# Altium schematic sheet FRONT_PWR.SchDoc: SDR200
size 420 x 297 mm; DocumentNumber: XXXX.468179.001 Э3; SheetNumber: 1; SheetTotal: 7; Title2str: Передняя панель; DocumentType: Схема электрическая принципиальная; Scale: 1:1
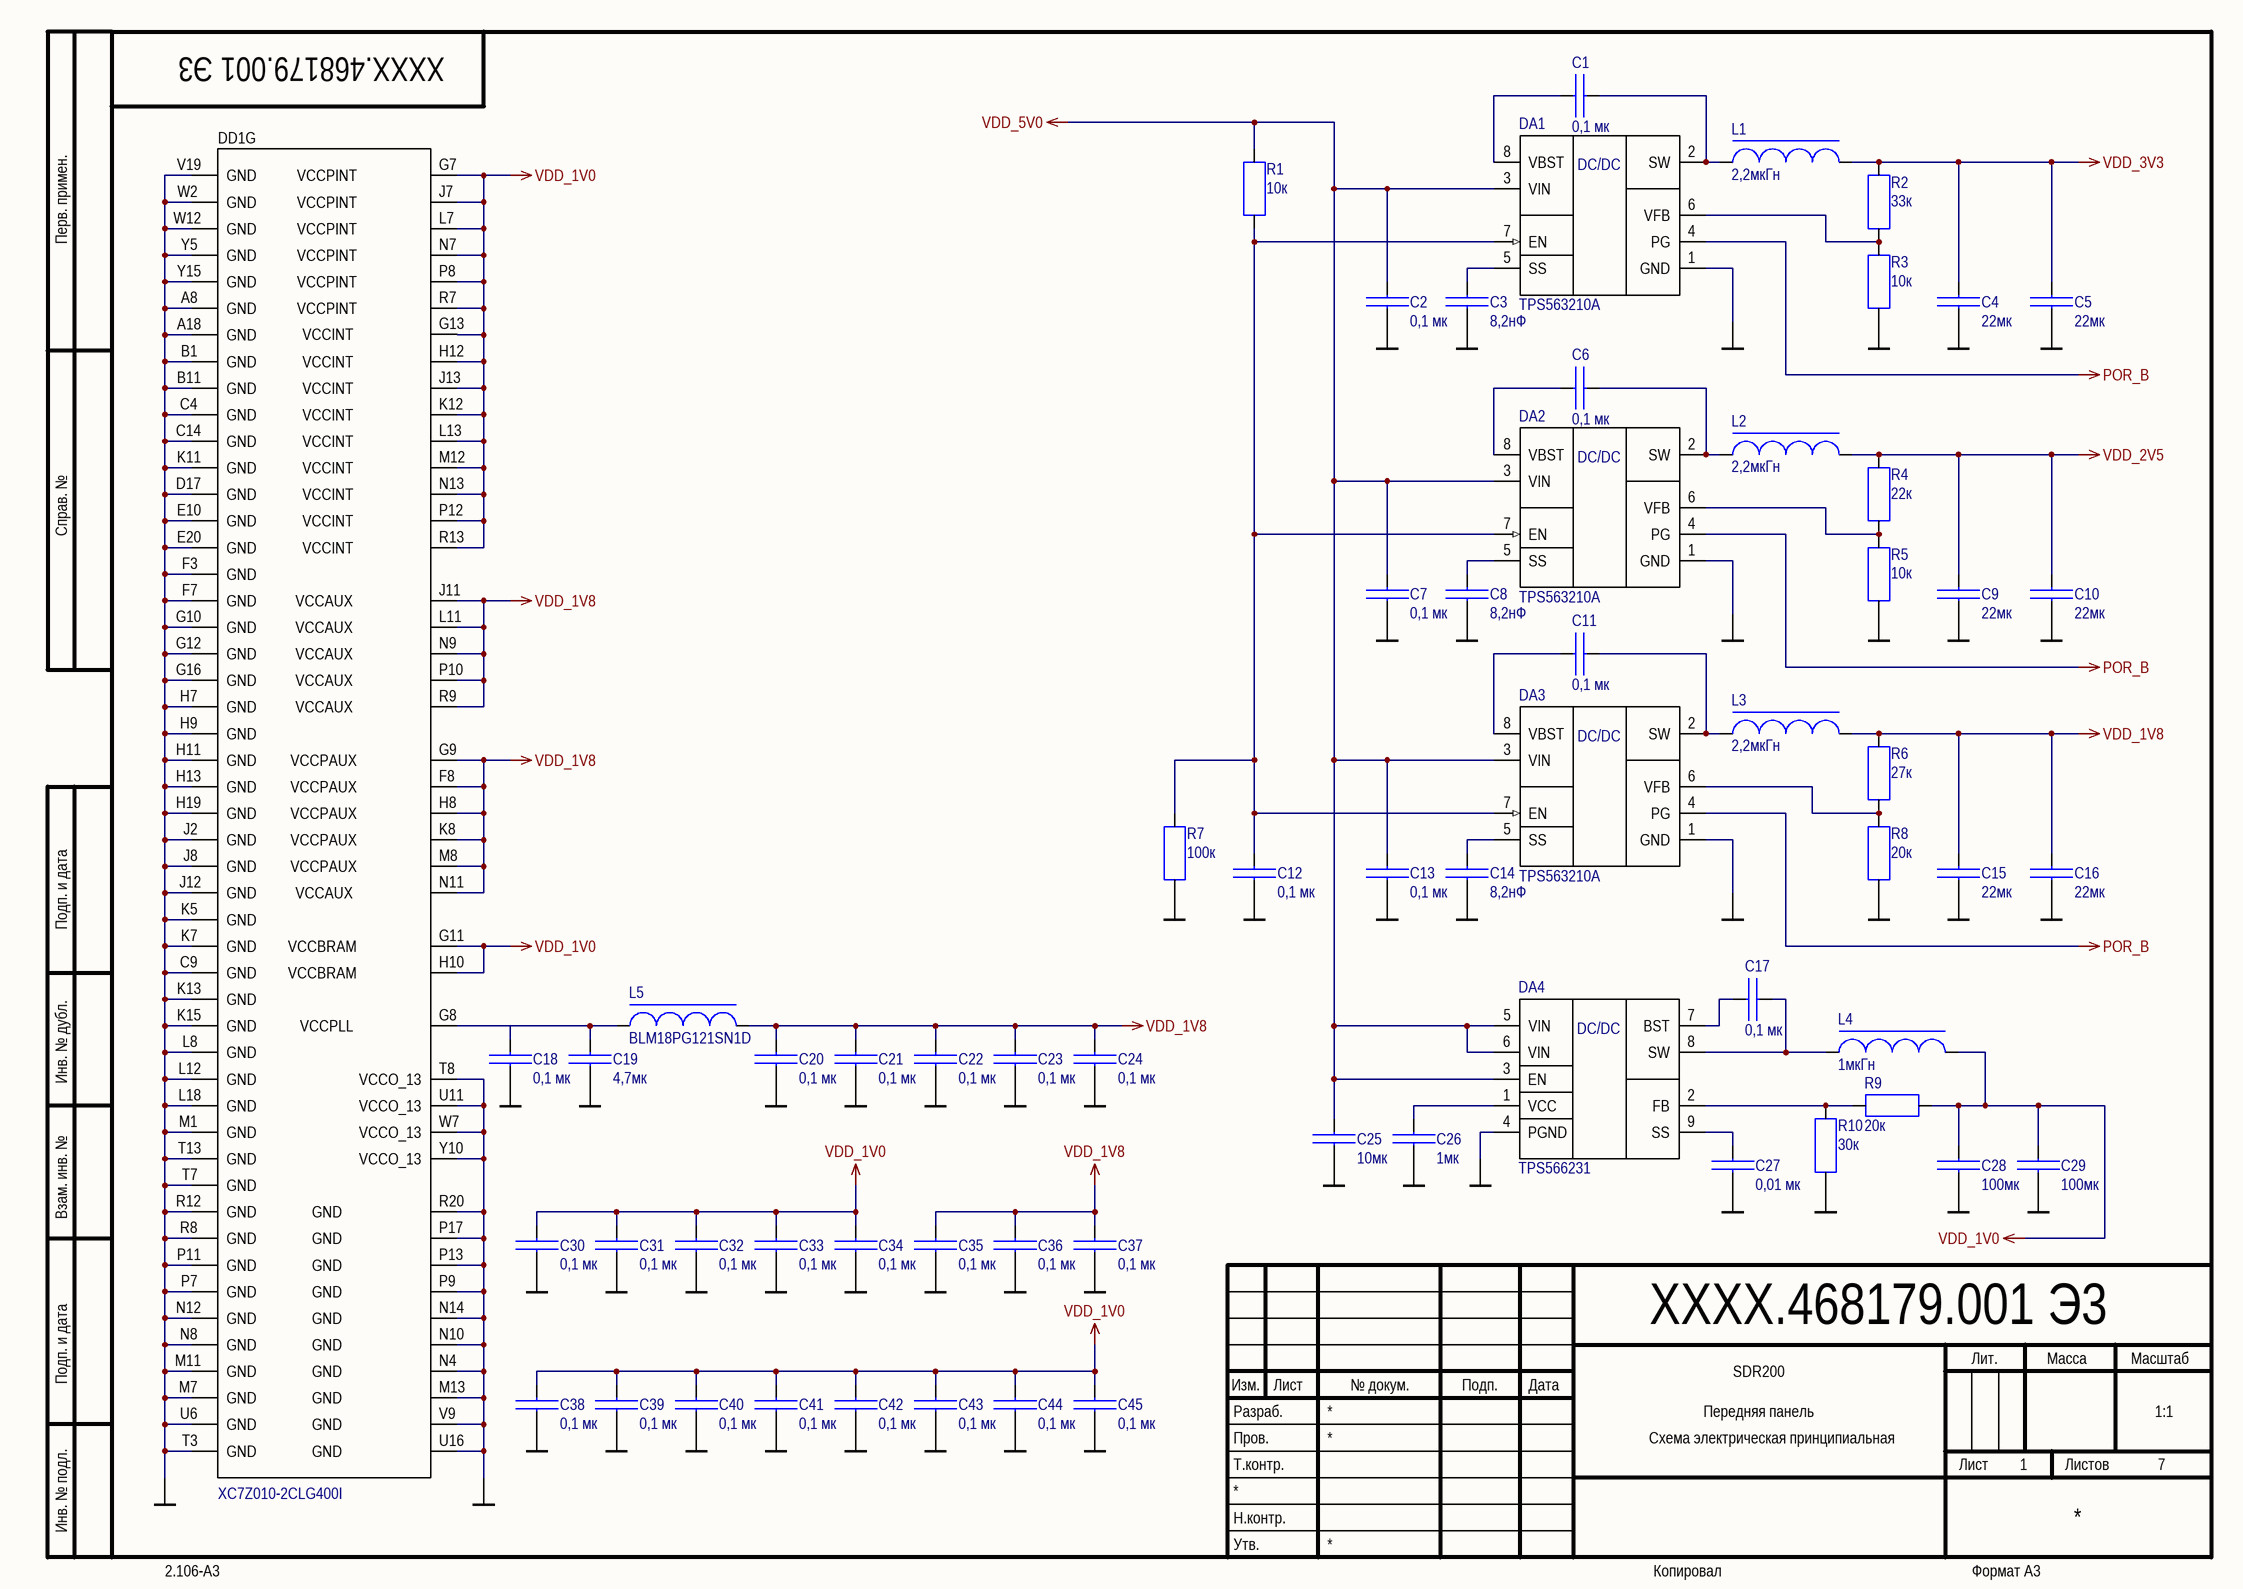
[diagram p0: FRONT_PWR.SchDoc]

## Parts
C1  Nominal: 0,1 мк  [CAPC1005X05L]  (hidden comment: CC0402KRX5R6BB104)
C2  Nominal: 0,1 мк  [CAPC1005X05L]  (hidden comment: CC0402KRX5R6BB104)
C3  Nominal: 8,2нФ  [CAPC1005X05L]  (hidden comment: CC0402KRX7R9BB822)
C4  Nominal: 22мк  [CAPC2012X09L]  (hidden comment: CC0805MKX5R5BB226)
C5  Nominal: 22мк  [CAPC2012X09L]  (hidden comment: CC0805MKX5R5BB226)
C6  Nominal: 0,1 мк  [CAPC1005X05L]  (hidden comment: CC0402KRX5R6BB104)
C7  Nominal: 0,1 мк  [CAPC1005X05L]  (hidden comment: CC0402KRX5R6BB104)
C8  Nominal: 8,2нФ  [CAPC1005X05L]  (hidden comment: CC0402KRX7R9BB822)
C9  Nominal: 22мк  [CAPC2012X09L]  (hidden comment: CC0805MKX5R5BB226)
C10  Nominal: 22мк  [CAPC2012X09L]  (hidden comment: CC0805MKX5R5BB226)
C11  Nominal: 0,1 мк  [CAPC1005X05L]  (hidden comment: CC0402KRX5R6BB104)
C12  Nominal: 0,1 мк  [CAPC1005X05L]  (hidden comment: CC0402KRX5R6BB104)
C13  Nominal: 0,1 мк  [CAPC1005X05L]  (hidden comment: CC0402KRX5R6BB104)
C14  Nominal: 8,2нФ  [CAPC1005X05L]  (hidden comment: CC0402KRX7R9BB822)
C15  Nominal: 22мк  [CAPC2012X09L]  (hidden comment: CC0805MKX5R5BB226)
C16  Nominal: 22мк  [CAPC2012X09L]  (hidden comment: CC0805MKX5R5BB226)
C17  Nominal: 0,1 мк  [CAPC1005X05L]  (hidden comment: CC0402KRX5R6BB104)
C18  Nominal: 0,1 мк  [CAPC1005X05L]  (hidden comment: CC0402KRX5R6BB104)
C19  Nominal: 4,7мк  [CAPC1608X08L]  (hidden comment: CC0603KRX5R6BB475)
C20  Nominal: 0,1 мк  [CAPC1005X05L]  (hidden comment: CC0402KRX5R6BB104)
C21  Nominal: 0,1 мк  [CAPC1005X05L]  (hidden comment: CC0402KRX5R6BB104)
C22  Nominal: 0,1 мк  [CAPC1005X05L]  (hidden comment: CC0402KRX5R6BB104)
C23  Nominal: 0,1 мк  [CAPC1005X05L]  (hidden comment: CC0402KRX5R6BB104)
C24  Nominal: 0,1 мк  [CAPC1005X05L]  (hidden comment: CC0402KRX5R6BB104)
C25  Nominal: 10мк  [CAPC2012X09L]  (hidden comment: CC0805KKX5R8BB106)
C26  Nominal: 1мк  [CAPC1005X05L]  (hidden comment: CC0402KRX5R5BB105)
C27  Nominal: 0,01 мк  [CAPC1005X05L]  (hidden comment: CC0402KRX7R9BB103)
C28  Nominal: 100мк  [CAPC3216X12L]  (hidden comment: CC1206MKX5R5BB107)
C29  Nominal: 100мк  [CAPC3216X12L]  (hidden comment: CC1206MKX5R5BB107)
C30  Nominal: 0,1 мк  [CAPC1005X05L]  (hidden comment: CC0402KRX5R6BB104)
C31  Nominal: 0,1 мк  [CAPC1005X05L]  (hidden comment: CC0402KRX5R6BB104)
C32  Nominal: 0,1 мк  [CAPC1005X05L]  (hidden comment: CC0402KRX5R6BB104)
C33  Nominal: 0,1 мк  [CAPC1005X05L]  (hidden comment: CC0402KRX5R6BB104)
C34  Nominal: 0,1 мк  [CAPC1005X05L]  (hidden comment: CC0402KRX5R6BB104)
C35  Nominal: 0,1 мк  [CAPC1005X05L]  (hidden comment: CC0402KRX5R6BB104)
C36  Nominal: 0,1 мк  [CAPC1005X05L]  (hidden comment: CC0402KRX5R6BB104)
C37  Nominal: 0,1 мк  [CAPC1005X05L]  (hidden comment: CC0402KRX5R6BB104)
C38  Nominal: 0,1 мк  [CAPC1005X05L]  (hidden comment: CC0402KRX5R6BB104)
C39  Nominal: 0,1 мк  [CAPC1005X05L]  (hidden comment: CC0402KRX5R6BB104)
C40  Nominal: 0,1 мк  [CAPC1005X05L]  (hidden comment: CC0402KRX5R6BB104)
C41  Nominal: 0,1 мк  [CAPC1005X05L]  (hidden comment: CC0402KRX5R6BB104)
C42  Nominal: 0,1 мк  [CAPC1005X05L]  (hidden comment: CC0402KRX5R6BB104)
C43  Nominal: 0,1 мк  [CAPC1005X05L]  (hidden comment: CC0402KRX5R6BB104)
C44  Nominal: 0,1 мк  [CAPC1005X05L]  (hidden comment: CC0402KRX5R6BB104)
C45  Nominal: 0,1 мк  [CAPC1005X05L]  (hidden comment: CC0402KRX5R6BB104)
DA1  TPS563210A  [TSOP65P280X110-8L]
DA2  TPS563210A  [TSOP65P280X110-8L]
DA3  TPS563210A  [TSOP65P280X110-8L]
DA4  TPS566231  [VQFN-HR 9]
DD1  XC7Z010-2CLG400I  [BGA400C80P20X20_1700X1700X147]  (part G of 7)
L1  Nominal: 2,2мкГн  [INDCXGL4020]  (hidden comment: XGL4020-222ME)
L2  Nominal: 2,2мкГн  [INDCXGL4020]  (hidden comment: XGL4020-222ME)
L3  Nominal: 2,2мкГн  [INDCXGL4020]  (hidden comment: XGL4020-222ME)
L4  Nominal: 1мкГн  [INDCXGL4020]  (hidden comment: XGL4020-102ME)
L5  BLM18PG121SN1D  [INDC1608X05L]
R1  Nominal: 10к  [RESC1005X04L]  (hidden comment: RC0402JR-0710KL)
R2  Nominal: 33к  [RESC1005X04L]  (hidden comment: RC0402JR-0733KL)
R3  Nominal: 10к  [RESC1005X04L]  (hidden comment: RC0402JR-0710KL)
R4  Nominal: 22к  [RESC1005X04L]  (hidden comment: RC0402JR-0722KL)
R5  Nominal: 10к  [RESC1005X04L]  (hidden comment: RC0402JR-0710KL)
R6  Nominal: 27к  [RESC1005X04L]  (hidden comment: RC0402JR-0727KL)
R7  Nominal: 100к  [RESC1005X04L]  (hidden comment: RC0402JR-07100KL)
R8  Nominal: 20к  [RESC1005X04L]  (hidden comment: RC0402JR-0720KL)
R9  Nominal: 20к  [RESC1005X04L]  (hidden comment: RC0402JR-0720KL)
R10  Nominal: 30к  [RESC1005X04L]  (hidden comment: RC0402JR-0730KL)

## Nets
GND: C2.1 C3.1 C4.1 C5.1 C7.1 C8.1 C9.1 C10.1 C12.1 C13.1 C14.1 C15.1 C16.1 C18.2 C19.1 C20.2 C21.2 C22.2 C23.2 C24.2 C25.1 C26.1 C27.1 C28.1 C29.1 C30.2 C31.2 C32.2 C33.2 C34.2 C35.2 C36.2 C37.2 C38.2 C39.2 C40.2 C41.2 C42.2 C43.2 C44.2 C45.2 DA1.1(GND) DA2.1(GND) DA3.1(GND) DA4.4(PGND) DD1.A8(GND) DD1.A18(GND) DD1.B1(GND) DD1.B11(GND) DD1.C4(GND) DD1.C9(GND) DD1.C14(GND) DD1.D17(GND) DD1.E10(GND) DD1.E20(GND) DD1.F3(GND) DD1.F7(GND) DD1.G10(GND) DD1.G12(GND) DD1.G16(GND) DD1.H7(GND) DD1.H9(GND) DD1.H11(GND) DD1.H13(GND) DD1.H19(GND) DD1.J2(GND) DD1.J8(GND) DD1.J12(GND) DD1.K5(GND) DD1.K7(GND) DD1.K11(GND) DD1.K13(GND) DD1.K15(GND) DD1.L8(GND) DD1.L12(GND) DD1.L18(GND) DD1.M1(GND) DD1.M7(GND) DD1.M11(GND) DD1.M13(GND) DD1.N4(GND) DD1.N8(GND) DD1.N10(GND) DD1.N12(GND) DD1.N14(GND) DD1.P7(GND) DD1.P9(GND) DD1.P11(GND) DD1.P13(GND) DD1.P17(GND) DD1.R8(GND) DD1.R12(GND) DD1.R20(GND) DD1.T3(GND) DD1.T7(GND) DD1.T8(VCCO_13) DD1.T13(GND) DD1.U6(GND) DD1.U11(VCCO_13) DD1.U16(GND) DD1.V9(GND) DD1.V19(GND) DD1.W2(GND) DD1.W7(VCCO_13) DD1.W12(GND) DD1.Y5(GND) DD1.Y10(VCCO_13) DD1.Y15(GND) R3.2 R5.2 R7.1 R8.2 R10.1
POR_B: DA1.4(PG) DA2.4(PG) DA3.4(PG)
VDD_1V0: C28.2 C29.2 C30.1 C31.1 C32.1 C33.1 C34.1 C38.1 C39.1 C40.1 C41.1 C42.1 C43.1 C44.1 C45.1 DD1.G7(VCCPINT) DD1.G11(VCCBRAM) DD1.H10(VCCBRAM) DD1.H12(VCCINT) DD1.J7(VCCPINT) DD1.J13(VCCINT) DD1.K12(VCCINT) DD1.L7(VCCPINT) DD1.L13(VCCINT) DD1.M12(VCCINT) DD1.N7(VCCPINT) DD1.N13(VCCINT) DD1.P8(VCCPINT) DD1.P12(VCCINT) DD1.R7(VCCPINT) DD1.R13(VCCINT) L4.1 R9.1
VDD_1V8: C15.2 C16.2 C20.1 C21.1 C22.1 C23.1 C24.1 C35.1 C36.1 C37.1 DD1.F8(VCCPAUX) DD1.G9(VCCPAUX) DD1.H8(VCCPAUX) DD1.J11(VCCAUX) DD1.K8(VCCPAUX) DD1.L11(VCCAUX) DD1.M8(VCCPAUX) DD1.N9(VCCAUX) DD1.N11(VCCAUX) DD1.P10(VCCAUX) DD1.R9(VCCAUX) L3.1 L5.1 R6.1
VDD_2V5: C9.2 C10.2 L2.1 R4.1
VDD_3V3: C4.2 C5.2 L1.1 R2.1
VDD_5V0: C2.2 C7.2 C13.2 C25.2 DA1.3(VIN) DA2.3(VIN) DA3.3(VIN) DA4.3(EN) DA4.5(VIN) DA4.6(VIN) R1.1
NetC1_1: C1.1 DA1.8(VBST)
NetC1_2: C1.2 DA1.2(SW) L1.2
NetC3_2: C3.2 DA1.5(SS)
NetC6_1: C6.1 DA2.8(VBST)
NetC6_2: C6.2 DA2.2(SW) L2.2
NetC8_2: C8.2 DA2.5(SS)
NetC11_1: C11.1 DA3.8(VBST)
NetC11_2: C11.2 DA3.2(SW) L3.2
NetC12_2: C12.2 DA1.7(EN) DA2.7(EN) DA3.7(EN) R1.2 R7.2
NetC14_2: C14.2 DA3.5(SS)
NetC17_1: C17.1 DA4.7(BST)
NetC17_2: C17.2 DA4.8(SW) L4.2
NetC18_1: C18.1 C19.2 DD1.G8(VCCPLL) L5.2
NetC26_2: C26.2 DA4.1(VCC)
NetC27_2: C27.2 DA4.9(SS)
NetDA1_6: DA1.6(VFB) R2.2 R3.1
NetDA2_6: DA2.6(VFB) R4.2 R5.1
NetDA3_6: DA3.6(VFB) R6.2 R8.1
NetDA4_2: DA4.2(FB) R9.2 R10.2

Not connected (* = marked no-connect by the designer): DD1 G13  (VCCINT___________________)

## Notes on the sheet
- Перв. примен.
- Справ. №
- Подп. и дата
- Инв. № дубл.
- Взам. инв. №
- Разраб.
- Изм.
- Лист
- № докум.
- Подп.
- Дата
- Лит.
- Масса
- Масштаб
- Пров.
- Т.контр.
- Листов
- Инв. № подл.
- Утв.
- Н.контр.
- 2.106-A3
- Копировал
- Формат А3
- (in symbol TPS563210A) DC/DC
- (in symbol TPS566231) DC/DC

## Library data of the parts
C1 C2 C6 C7 C11-C13 C17 C18 C20-C24 C30-C45 = CC0402KRX5R6BB104: ЧИП конденсатор; Manufacturer: Yageo; ID: 0402 0,1 мкФ 10В X7R; Tolerance: 10%; Type: X7R; Value: 0402 0,1 мкФ 10В X7R; RuNominal: 0,1 мкФ; Voltage: 10В; ManufacturerPartNumber: CC0402KRX5R6BB104; Rem: *
C3 C8 C14 = CC0402KRX7R9BB822: ЧИП конденсатор; Manufacturer: Yageo; ID: 0402 8,2 нФ 50В X7R; Tolerance: 10%; Type: X7R; Value: 0402 8,2 нФ 50В X7R; RuNominal: 8,2 нФ; Voltage: 50В; ManufacturerPartNumber: CC0402KRX7R9BB822; Rem: *
C4 C5 C9 C10 C15 C16 = CC0805MKX5R5BB226: ЧИП конденсатор; Manufacturer: Yageo; ID: 0805 22 мкФ 6,3В X5R; Tolerance: 0,2; Type: X5R; Value: 0805 22 мкФ 6,3В X5R; RuNominal: 22 мкФ; Voltage: 6,3В; ManufacturerPartNumber: CC0805MKX5R5BB226; Rem: *
C19 = CC0603KRX5R6BB475: ЧИП конденсатор; Manufacturer: Yageo; ID: 0603 4,7 мкФ 10В X5R; Tolerance: 10%; Type: X5R; Value: 0603 4,7 мкФ 10В X5R; RuNominal: 4,7 мкФ; Voltage: 10В; ManufacturerPartNumber: CC0603KRX5R6BB475; Rem: *
C25 = CC0805KKX5R8BB106: ЧИП конденсатор; Manufacturer: Yageo; ID: 0805 10 мкФ 25В X7R; Tolerance: 0,1; Type: X7R; Value: 0805 10 мкФ 25В X7R; RuNominal: 10 мкФ; Voltage: 25В; ManufacturerPartNumber: CC0805KKX5R8BB106; Rem: *
C26 = CC0402KRX5R5BB105: ЧИП конденсатор; Manufacturer: Yageo; ID: 0402 1 мкФ 6,3В X5R; Tolerance: 10%; Type: X5R; Value: 0402 1 мкФ 6,3В X5R; RuNominal: 1 мкФ; Voltage: 6,3В; ManufacturerPartNumber: CC0402KRX5R5BB105; Rem: *
C27 = CC0402KRX7R9BB103: ЧИП конденсатор; Manufacturer: Yageo; ID: 0402 10 нФ 50В X7R; Tolerance: 10%; Type: X7R; Value: 0402 10 нФ 50В X7R; RuNominal: 10 нФ; Voltage: 50В; ManufacturerPartNumber: CC0402KRX7R9BB103; Rem: *
C28 C29 = CC1206MKX5R5BB107: ЧИП конденсатор; Manufacturer: Yageo; ID: 1206 100 мкФ 6,3В X5R; Tolerance: 20%; Type: X5R; Value: 1206 100 мкФ 6,3В X5R; RuNominal: 100 мкФ; Voltage: 6,3В; ManufacturerPartNumber: CC1206MKX5R5BB107; Rem: *
DA1-DA3 = TPS563210A: TPS56x210A, 4.5-V to 17-V Input, 2-A, 3-A Synchrono; Manufacturer: TI; Value: TPS563210A; ComponentLink1Description: datasheet; ComponentLink1URL: https://www.ti.com/lit/ds/symlink/tps563210a.pdf?ts=1769179342855&ref_url=https%253A%252F%252Fwww.ti.com%252Fproduct%252FTPS563210A; ManufacturerPartNumber: TPS563210A; Rem: *
DA4 = TPS566231: 3-V to 18-V Input, 6-A Synchronous Step-Down Voltage Regulator; Value: TPS566231; ComponentLink1Description: datasheet; ComponentLink1URL: https://www.ti.com/lit/ds/symlink/tps566231.pdf?ts=1764277568408
DD1 = XC7Z010-2CLG400I: Zynq®-7000 SoC Family; Manufacturer: Xilinx; ManufacturerPartNumber: XC7Z010-2CLG400I; Value: XC7Z010-2CLG400I
L1-L3 = XGL4020-222ME: Shielded Power Inductors; Manufacturer: Coilcraft; ID: XGL4020 2,2мкГн; Value: XGL4020 2,2мкГн; Current: 2,7А; DC Res: 19,5mOhms; ManufacturerPartNumber: XGL4020-222ME
L4 = XGL4020-102ME: Shielded Power Inductors; Manufacturer: Coilcraft; ID: XGL4020 1мкГн; Value: XGL4020 1мкГн; Current: 3,8А; DC Res: 8,2mOhms; ManufacturerPartNumber: XGL4020-102ME
L5 = BLM18PG121SN1D: Chip Ferrite Beads (0603 Size); Manufacturer: Murata; Rem: 120ohm ±25%; Current: 2000mA; DC Res: 0.05ohm; Nominal: BLM18PG121SN1D; ID: BLM18PG121SN1D; ManufacturerPartNumber: BLM18PG121SN1D; Value: BLM18PG121SN1D
R1 R3 R5 = RC0402JR-0710KL: ЧИП резистор; Manufacturer: Yageo; ID: 0402 10 кОм 5%; Tolerance: 5%; Value: 0402 10 кОм 5%; ManufacturerPartNumber: RC0402JR-0710KL; Rem: *; Type: *
R2 = RC0402JR-0733KL: ЧИП резистор; Manufacturer: Yageo; ID: 0402 33 кОм 5%; Tolerance: 5%; Value: 0402 33 кОм 5%; ManufacturerPartNumber: RC0402JR-0733KL; Rem: *; Type: *
R4 = RC0402JR-0722KL: ЧИП резистор; Manufacturer: Yageo; ID: 0402 22 кОм 5%; Tolerance: 5%; Value: 0402 22 кОм 5%; ManufacturerPartNumber: RC0402JR-0722KL; Rem: *; Type: *
R6 = RC0402JR-0727KL: ЧИП резистор; Manufacturer: Yageo; ID: 0402 27 кОм 5%; Tolerance: 5%; Value: 0402 27 кОм 5%; ManufacturerPartNumber: RC0402JR-0727KL; Rem: *; Type: *
R7 = RC0402JR-07100KL: ЧИП резистор; Manufacturer: Yageo; ID: 0402 100 кОм 5%; Tolerance: 5%; Value: 0402 100 кОм 5%; ManufacturerPartNumber: RC0402JR-07100KL; Rem: *; Type: *
R8 R9 = RC0402JR-0720KL: ЧИП резистор; Manufacturer: Yageo; ID: 0402 20 кОм 5%; Tolerance: 5%; Value: 0402 20 кОм 5%; ManufacturerPartNumber: RC0402JR-0720KL; Rem: *; Type: *
R10 = RC0402JR-0730KL: ЧИП резистор; Manufacturer: Yageo; ID: 0402 30 кОм 5%; Tolerance: 5%; Value: 0402 30 кОм 5%; ManufacturerPartNumber: RC0402JR-0730KL; Rem: *; Type: *